# EAGLE design M410A (EAGLE 6.6.0)
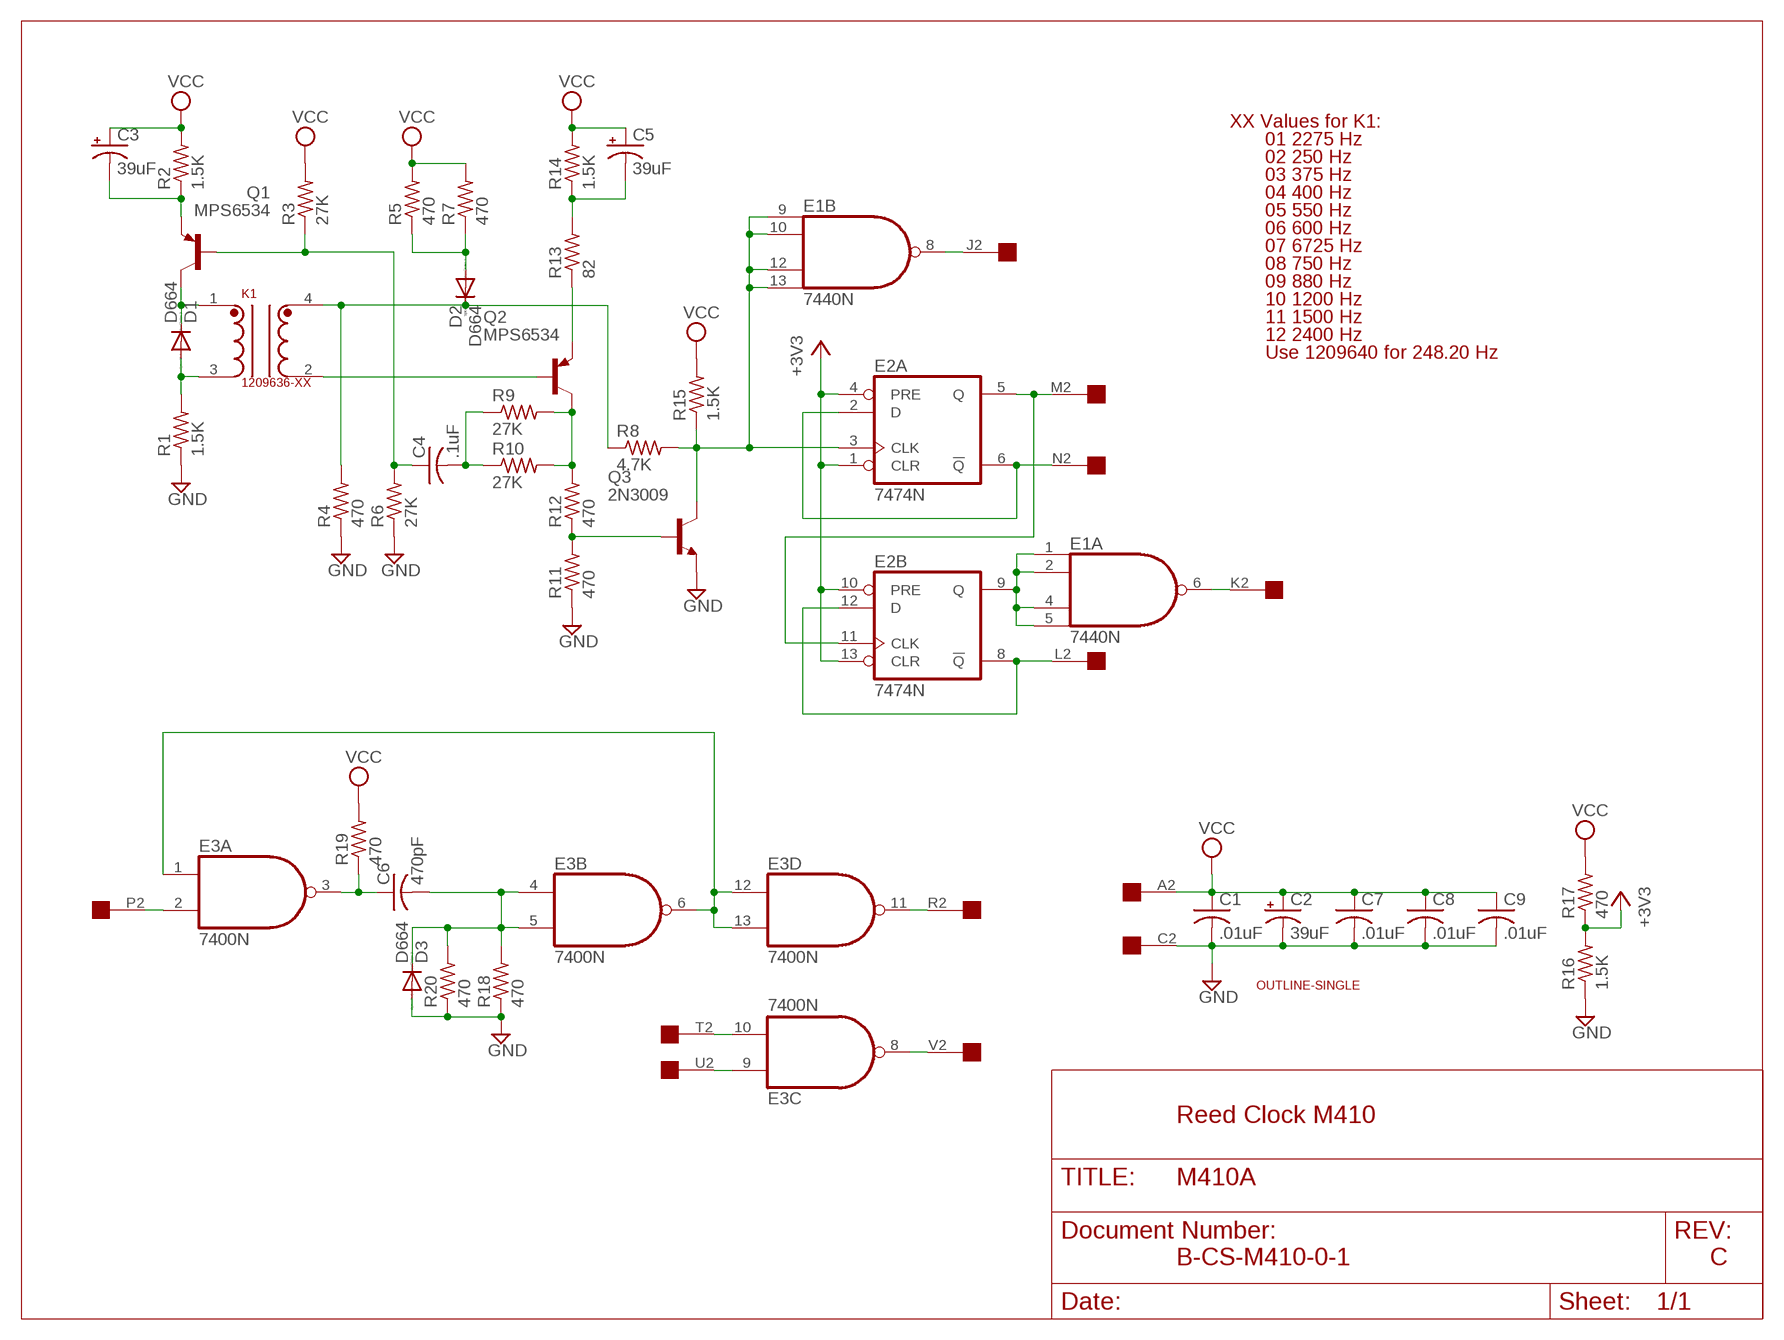
[diagram p0: schematic, sheet 1]

## Parts
C1  .01uF  C-US050-025X075  [C050-025X075]
C2  39uF  CPOL-USE20-8AXIAL  [E12-8]
C3  39uF  CPOL-USE20-8AXIAL  [E12-8]
C4  .1uF  C-US150-054X183  [C150-054X183]
C5  39uF  CPOL-USE20-8AXIAL  [E12-8]
C6  470pF  C-US075-032X103  [C075-032X103]
C7  .01uF  C-US050-025X075  [C050-025X075]
C8  .01uF  C-US050-025X075  [C050-025X075]
C9  .01uF  C-US050-025X075  [C050-025X075]
D1  D664  DIODE-DO35-10  [DO35-10]
D2  D664  DIODE-DO35-10  [DO35-10]
D3  D664  DIODE-DO35-10  [DO35-10]
E1  7440N  [DIL14]
E2  7474N  74S74N  [DIL14]
E3  7400N  [DIL14]
K1  1209636-XX  RESONATOR  [RESONATOR]
Q1  MPS6534  -PNP-TO5  [TO5]
Q2  MPS6534  -PNP-TO5  [TO5]
Q3  2N3009  -NPN-TO5  [TO5]
R1  1.5K  R-US_0207/10  [0207/10]
R2  1.5K  R-US_0207/10  [0207/10]
R3  27K  R-US_0207/10  [0207/10]
R4  470  R-US_0207/10  [0207/10]
R5  470  R-US_0207/10  [0207/10]
R6  27K  R-US_0207/10  [0207/10]
R7  470  R-US_0207/10  [0207/10]
R8  4.7K  R-US_0207/10  [0207/10]
R9  27K  R-US_0207/10  [0207/10]
R10  27K  R-US_0207/10  [0207/10]
R11  470  R-US_0207/10  [0207/10]
R12  470  R-US_0207/10  [0207/10]
R13  82  R-US_0207/10  [0207/10]
R14  1.5K  R-US_0207/10  [0207/10]
R15  1.5K  R-US_0207/10  [0207/10]
R16  1.5K  R-US_0207/10  [0207/10]
R17  470  R-US_0207/10  [0207/10]
R18  470  R-US_0207/10  [0207/10]
R19  470  R-US_0207/10  [0207/10]
R20  470  R-US_0207/10  [0207/10]
U$1  OUTLINE-SINGLE  [SINGLE]
U$3  EDGE-1  [EDGE-CON1]

## Nets
+3V3: E2.1(A:CLR) E2.4(A:PRE) E2.10(B:PRE) E2.13(B:CLR) R16.2 R17.1
GND: C1.2 C2.- C7.2 C8.2 C9.2 D3.A Q3.1(E) R1.1 R4.1 R6.1 R11.1 R16.1 R18.1 R20.1 U$3.C2
N$1: E3.8(C:O) U$3.V2
N$2: E3.10(C:I1) U$3.T2
N$3: E3.9(C:I0) U$3.U2
N$4: E3.1(A:I0) E3.6(B:O) E3.12(D:I0) E3.13(D:I1)
N$5: E3.11(D:O) U$3.R2
N$6: C6.2 D3.C E3.4(B:I0) E3.5(B:I1) R18.2 R20.2
N$7: C6.1 E3.3(A:O) R19.1
N$8: E2.2(A:D) E2.6(A:!Q) U$3.N2
N$9: E2.5(A:Q) E2.11(B:CLK) U$3.M2
N$10: E2.8(B:!Q) E2.12(B:D) U$3.L2
N$11: E1.1(A:I0) E1.2(A:I1) E1.4(A:I2) E1.5(A:I3) E2.9(B:Q)
N$12: E1.6(A:O) U$3.K2
N$13: C3.- Q1.1(E) R2.1
N$14: E1.9(B:I0) E1.10(B:I1) E1.12(B:I2) E1.13(B:I3) E2.3(A:CLK) Q3.3(C) R8.2 R15.1
N$15: E1.8(B:O) U$3.J2
N$16: E3.2(A:I1) U$3.P2
N$17: D1.A K1.3 R1.2
N$18: D1.C K1.1 Q1.3(C)
N$19: C4.1 Q1.2(B) R3.1 R6.2
N$20: D2.A R5.1 R7.1
N$21: K1.2 Q2.2(B)
N$22: D2.C K1.4 R4.2 R8.1
N$23: C4.2 R9.1 R10.1
N$24: Q2.3(C) R9.2 R10.2 R12.2
N$26: C5.- R13.2 R14.1
N$27: Q2.1(E) R13.1
N$28: Q3.2(B) R11.2 R12.1
VCC: C1.1 C2.+ C3.+ C5.+ C7.1 C8.1 C9.1 R2.2 R3.2 R5.2 R7.2 R14.2 R15.2 R17.2 R19.2 U$3.A2
Unconnected: E1.3(3:NC) E1.11(11:NC) U$3.B2 U$3.D2 U$3.E2 U$3.F2 U$3.H2 U$3.S2

## Notes on the sheet
- XX Values for K1:
- 01 2275 Hz
- 02 250 Hz
- 03 375 Hz
- 04 400 Hz
- 05 550 Hz
- 06 600 Hz
- 07 6725 Hz
- 08 750 Hz
- 09 880 Hz
- 10 1200 Hz
- 11 1500 Hz
- 12 2400 Hz
- Use 1209640 for 248.20 Hz
- Reed Clock M410
- B-CS-M410-0-1 | C

## Power pins joined to a net without a drawn wire
GND: E1.7(P:GND) E2.7(P:GND) E3.7(P:GND)
VCC: E1.14(P:VCC) E2.14(P:VCC) E3.14(P:VCC)

## Library data of the parts
C1 C4 C6-C9 = rcl:C-US: CAPACITOR, American symbol
C2 C3 C5 = dec-con:CPOL-USE20-8AXIAL: A 0.8 inch electrolytic.
D1-D3 = diode:DIODE-: DIODE
E1 = dec-con:74*40: Dual 4-input NAND gate
E2 = 74xx-us:74*74: Dual D type positive edge triggered FLIP FLOP, preset and clear
E3 = 74xx-us:74*00: Quad 2-input NAND gate
K1 = dec-con:RESONATOR: Reed Resonator
Q1 Q2 = transistor:*-PNP-: PNP Transistror
Q3 = transistor:*-NPN-: NPN Transistror BF959 corrected 2008.03.06
R1-R20 = rcl:R-US_: RESISTOR, American symbol
U$1 = dec-con:OUTLINE-*: Board outlines for DEC boards.
U$3 = dec-con:EDGE-1: Single-Sided DEC Edge Connector -- (side 2)

## Net classes
0 default: width 0.813 mm

## Board
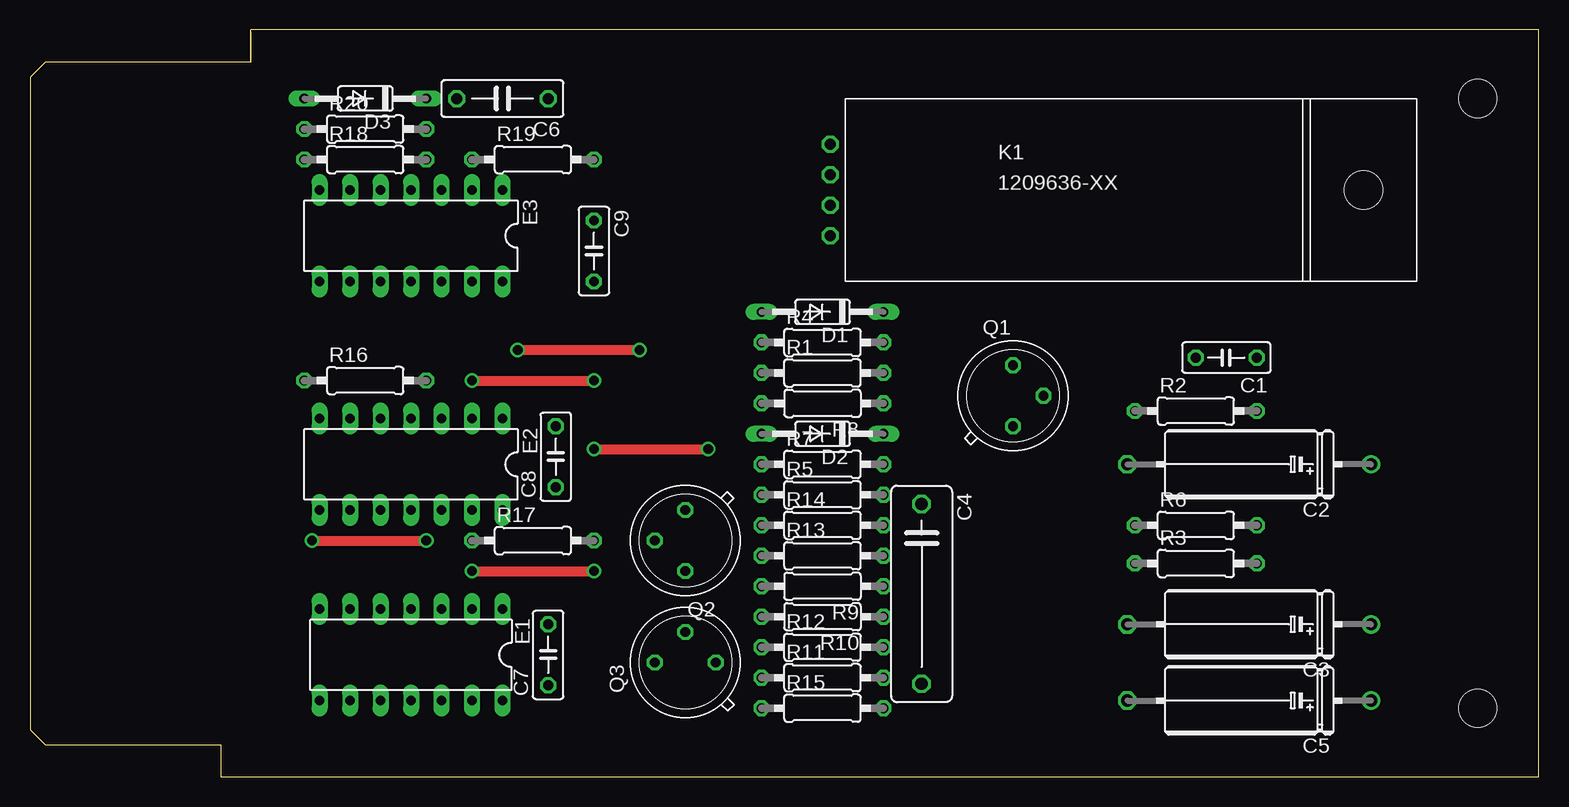
[diagram p1: board, top side]
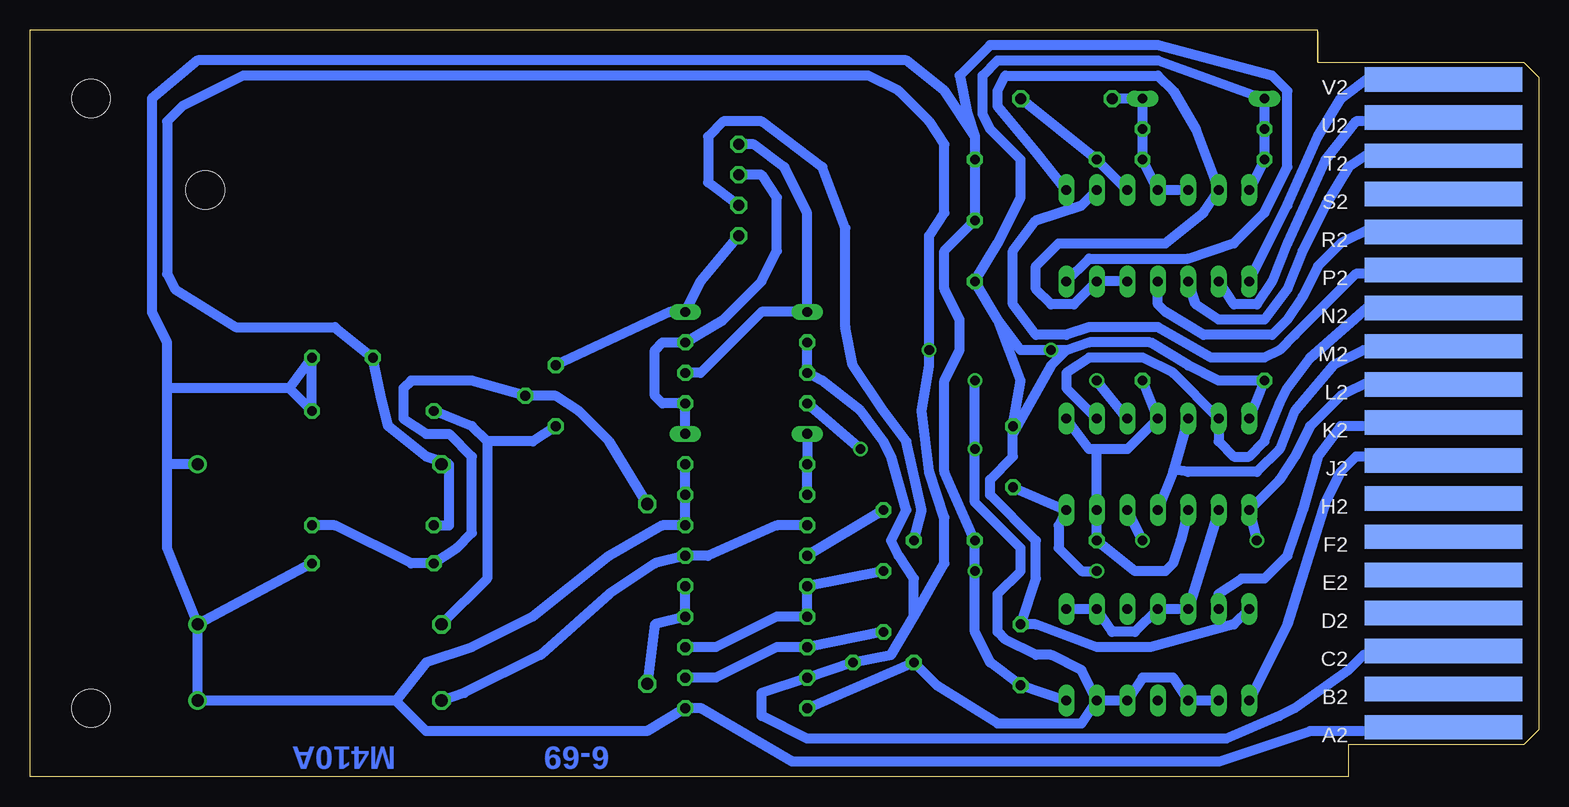
[diagram p2: board, bottom side, seen from below]

Size 125.73 x 62.23 mm. Coordinates in mm from the lower left corner, seen from the top.
Copper layers (1+16): Top 0.035mm / dielectric 1.5mm / Bottom 0.035mm
Design rules "16mils": minimum track width 16mil, minimum drill 32mil, track to track 15mil, track to pad 10mil, pad to pad 10mil, via to via 10mil, smd to smd 10mil, copper to edge 13mil, drill to drill 10mil, minimum pad ring 10mil, minimum via ring 8mil, stop-mask expansion 0mil, vias tented up to drill 0mil, thermal gap 10mil

### Footprints (pad centres in the part's own frame; a part is rotated, then mirrored left to right if it is on the bottom)
C050-025X075 = drill 0.813 octagon: 1 -2.54,0; 2 2.54,0
E12-8 = drill 1.016: + -10.16,0 | drill 1.016 octagon: - 10.16,0
C150-054X183 = drill 1.016 octagon: 1 -7.493,0; 2 7.493,0
C075-032X103 = drill 0.914 octagon: 1 -3.81,0; 2 3.81,0
DO35-10 = drill 0.813 long: A 5.08,0; C -5.08,0
DIL14 = drill 0.813 long: 1 -7.62,-3.81; 2 -5.08,-3.81; 3 -2.54,-3.81; 4 0,-3.81; 5 2.54,-3.81; 6 5.08,-3.81; 7 7.62,-3.81; 8 7.62,3.81; 9 5.08,3.81; 10 2.54,3.81; 11 0,3.81; 12 -2.54,3.81; 13 -5.08,3.81; 14 -7.62,3.81
RESONATOR = drill 0.9 octagon: 1 -1.27,3.81; 2 -1.27,6.35; 3 -1.27,11.43; 4 -1.27,8.89 | hole 3.2: 43.18,7.62
TO5 = drill 0.813 octagon: 1 0,-2.54; 2 2.54,0; 3 0,2.54
0207/10 = drill 0.813 octagon: 1 -5.08,0; 2 5.08,0
SINGLE = hole 3.175: 120.65,56.515; 120.65,5.715
EDGE-CON1 = smd 13.106 x 2.032 bottom: A2 7.938,4.128; B2 7.938,7.303; C2 7.938,10.477; D2 7.938,13.652; E2 7.938,16.828; F2 7.938,20.003; H2 7.938,23.177; J2 7.938,26.352; K2 7.938,29.527; L2 7.938,32.703; M2 7.938,35.877; N2 7.938,39.053; P2 7.938,42.227; R2 7.938,45.403; S2 7.938,48.578; T2 7.938,51.752; U2 7.938,54.928; V2 7.938,58.102

### Placement (x,y rotation side)
C1  99.7,34.92 180 top
C2  101.6,26.04 180 top
C3  101.6,12.7 180 top
C4  74.3,15.24 270 top
C5  101.6,6.35 180 top
C6  39.37,56.52 180 top
C7  43.18,10.16 90 top
C8  43.82,26.67 90 top
C9  46.99,43.81 270 top
D1  66.04,38.73 180 top
D2  66.04,28.57 180 top
D3  27.94,56.52 180 top
E1  31.75,10.16 180 top
E2  31.75,26.04 180 top
E3  31.75,45.09 180 top
K1  67.95,41.27 0 top
Q1  81.92,31.75 0 top
Q2  54.61,19.68 180 top
Q3  54.61,9.53 90 top
R1  66.04,33.66 0 top
R2  97.16,30.48 0 top
R3  97.16,17.78 0 top
R4  66.04,36.2 0 top
R5  66.04,23.5 0 top
R6  97.16,20.95 0 top
R7  66.04,26.04 0 top
R8  66.04,31.11 180 top
R9  66.04,15.88 180 top
R10  66.04,13.34 180 top
R11  66.04,8.26 0 top
R12  66.04,10.79 0 top
R13  66.04,18.41 0 top
R14  66.04,20.95 0 top
R15  66.04,5.71 0 top
R16  27.94,33.02 0 top
R17  41.91,19.68 0 top
R18  27.94,51.44 0 top
R19  41.91,51.44 0 top
R20  27.94,53.98 0 top
U$1  0,0 0 top
U$3  0,0 0 top

### Tracks (layer width: path | path; a pad name or v marks a point on that pad's centre or on a via)
+3V3
  Bottom 0.813: 36.83,27.3 34.29,27.3 E2.4 R16.2 | 36.83,27.3 37.47,27.3 E2.1 | 36.83,27.3 E2.13 R17.1 33.66,17.14 31.12,17.14 30.48,17.78 29.85,19.68 E2.10
GND  (via drill 0.81)
  Top 0.813: v50.8,35.56 v40.64,35.56
  Bottom 0.813: U$3.C2 8.89,10.48 8.89,10.16 14.61,10.16 15.88,8.89 20.32,5.71 21.59,5.08 26.04,3.17 60.96,3.17 64.77,5.08 64.77,6.99 R11.1 Q3.1 53.98,10.16 52.07,13.34 | 52.07,13.34 52.07,16.51 53.34,18.41 53.98,19.68 52.71,22.23 53.98,26.67 54.61,27.94 56.52,30.48 59.69,33.02 R1.1 R4.1 | E1.7 25.4,12.7 32.39,10.79 36.83,10.79 41.91,12.7 C7.2 41.91,16.51 41.91,19.68 45.72,23.5 45.72,24.77 43.82,26.67 43.82,28.57 | 43.82,28.57 C8.2 43.18,33.02 45.09,38.1 | E2.7 R16.1 26.67,33.02 29.21,34.29 32.39,36.2 37.47,36.2 39.37,35.56 | 39.37,35.56 v40.64,35.56 43.18,35.56 45.09,38.1 | 39.37,35.56 40.64,34.29 43.82,28.57 | 45.09,38.1 C9.2 45.09,44.45 43.18,48.26 43.18,51.44 45.72,53.98 46.36,55.24 46.36,58.42 45.09,59.69 31.75,59.69 D3.A R20.1 R18.1 E3.7 | R6.1 90.81,20.95 90.81,26.04 | C2.- 90.81,26.04 | 90.81,26.04 92.71,26.67 95.89,29.21 96.52,31.75 C1.2 100.33,37.47 108.59,37.47 113.67,40.64 114.3,41.91 114.3,54.61 113.03,55.88 107.95,58.42 55.88,58.42 53.34,57.15 50.8,54.61 49.53,52.7 49.53,46.99 50.8,45.09 v50.8,35.56 50.8,34.29 51.44,30.48 50.8,25.4 49.53,21.59 49.53,17.78 52.07,13.34
N$1
  Bottom 0.813: E3.8 20.96,47.62 18.42,53.34 16.51,56.52 13.97,58.42 8.89,58.42 U$3.V2
N$2
  Bottom 0.813: U$3.T2 8.89,52.07 13.97,52.07 15.88,50.8 17.78,47.62 19.69,43.81 20.96,40.64 22.86,38.1 26.67,38.1 28.58,39.37 E3.10
N$3
  Bottom 0.813: U$3.U2 8.89,54.61 15.24,54.61 17.78,51.44 20.96,44.45 22.23,41.27 23.5,39.37 25.4,39.37 E3.9
N$4
  Bottom 0.813: E3.12 E3.13 38.74,39.37 40.64,39.37 41.91,40.64 41.91,42.55 40.01,44.45 31.12,44.45 27.94,46.99 E3.6 28.58,53.98 30.48,57.15 31.75,58.42 44.45,58.42 45.09,57.15 45.09,55.88 41.91,52.07 E3.1
N$5
  Bottom 0.813: U$3.R2 8.89,45.72 13.97,45.72 16.51,44.45 18.42,42.55 19.69,40.01 20.96,38.1 22.23,36.83 27.94,36.83 31.12,38.73 31.75,39.37 E3.11
N$6
  Bottom 0.813: E3.5 E3.4 R18.2 R20.2 D3.C C6.2
N$7
  Bottom 0.813: E3.3 R19.1 C6.1
N$8
  Bottom 0.813: U$3.N2 8.89,39.37 13.97,39.37 19.05,34.92 20.96,32.38 21.59,31.11 22.86,27.94 24.13,26.67 25.4,26.67 26.67,27.94 E2.6 30.48,33.66 33.02,34.92 37.47,34.92 39.37,33.66 39.37,32.38 E2.2
N$9
  Bottom 0.813: E2.5 30.43,25.57 | 30.43,25.57 30.48,25.4 E2.11 | U$3.M2 8.89,35.56 14.61,35.56 17.15,34.29 20.32,30.48 21.59,27.3 23.5,25.4 29.21,25.4 30.43,25.57
N$10  (via drill 0.81)
  Top 0.813: v23.5,19.68 v33.02,19.68
  Bottom 0.813: v23.5,19.68 E2.8 21.59,24.77 20.32,26.67 19.05,29.21 16.51,31.75 13.97,33.02 8.89,33.02 U$3.L2 | v33.02,19.68 E2.12
N$11
  Bottom 0.813: E2.9 E1.5 E1.4 33.66,12.06 35.56,12.06 E1.2 E1.1
N$12
  Bottom 0.813: U$3.K2 8.89,29.21 16.51,29.21 18.42,26.67 19.69,22.23 20.96,18.41 22.86,16.51 24.77,16.51 26.67,15.24 E1.6
N$13
  Bottom 0.813: Q1.1 83.82,27.94 87.63,27.94 | 87.63,27.94 87.63,16.51 C3.- | 87.63,27.94 88.9,29.21 R2.1
N$14  (via drill 0.81)
  Top 0.813: v36.83,33.02 v46.99,33.02 | v46.99,27.3 v56.52,27.3
  Bottom 0.813: E1.9 E1.10 30.48,8.26 33.02,8.26 E1.12 E1.13 | E1.13 38.1,4.45 45.09,4.45 50.17,7.62 Q3.3 R15.1 | E1.13 38.1,8.89 40.64,10.16 41.91,10.16 44.45,11.43 45.09,12.06 45.09,15.24 43.18,17.14 43.18,19.05 46.99,22.86 v46.99,27.3 v46.99,33.02 | E2.3 v36.83,33.02 | R8.2 v56.52,27.3
N$15
  Bottom 0.813: U$3.J2 8.89,26.67 15.24,26.67 16.51,25.4 17.78,22.86 20.96,12.7 E1.8
N$16
  Bottom 0.813: U$3.P2 8.89,41.91 15.24,41.91 20.32,36.83 21.59,35.56 22.86,34.92 27.31,34.92 31.75,37.47 37.47,37.47 39.37,36.83 41.91,36.83 43.82,39.37 43.82,43.81 41.91,46.35 38.1,47.62 E3.2
N$17
  Bottom 0.813: R1.2 69.85,33.66 64.77,38.73 D1.A 60.96,46.99 62.87,50.8 65.41,52.7 K1.3
N$18
  Bottom 0.813: Q1.3 72.39,38.73 D1.C 69.85,41.27 K1.1
N$19
  Bottom 0.813: R6.2 100.33,20.95 93.98,17.78 R3.1 90.17,19.05 88.9,20.32 88.9,26.67 90.81,28.57 92.71,28.57 94.62,29.84 94.62,32.38 93.98,33.02 88.9,33.02 Q1.2 81.92,31.75 80.01,30.48 77.47,27.94 C4.1
N$20
  Bottom 0.813: R5.1 R7.1 D2.A
N$21
  Bottom 0.813: Q2.2 51.44,22.23 52.71,27.94 54.61,30.48 57.15,34.29 57.79,37.47 57.79,45.72 59.69,50.8 64.77,54.61 67.95,54.61 69.22,53.34 69.22,49.53 K1.2
N$22
  Bottom 0.813: D2.C R8.1 73.03,31.11 73.66,31.75 73.66,35.56 73.03,36.2 R4.2 67.95,38.1 64.77,41.27 63.5,43.81 63.5,48.26 64.77,50.16 K1.4
N$23
  Bottom 0.813: R9.1 R10.1 73.66,12.7 C4.2 74.3,7.62
N$24
  Bottom 0.813: R12.2 68.58,10.79 63.5,13.34 R10.2 R9.2 Q2.3
N$26
  Bottom 0.813: R14.1 63.5,20.95 69.22,18.41 R13.2 73.66,17.78 77.47,15.24 83.19,10.16 89.54,6.99 C5.-
N$27
  Bottom 0.813: Q2.1 R13.1
N$28
  Bottom 0.813: Q3.2 R12.1 63.5,10.79 68.58,8.26 R11.2
VCC  (via drill 0.81)
  Top 0.813: v36.83,17.14 v46.99,17.14
  Bottom 0.813: U$3.A2 8.89,3.81 19.05,3.81 26.67,1.27 62.23,1.27 69.85,5.71 R15.2 74.3,3.81 92.71,3.81 95.25,6.35 | 95.25,6.35 C5.+ C3.+ | C3.+ 114.3,19.05 114.3,26.04 | 114.3,26.04 114.3,32.38 | 114.3,32.38 114.3,36.2 115.57,38.73 115.57,56.52 111.76,59.69 52.71,59.69 49.53,57.15 46.99,53.34 | E1.14 C7.1 45.72,9.53 46.99,12.06 v46.99,17.14 R17.2 49.53,25.4 49.53,33.02 48.26,35.56 48.26,38.1 49.53,40.64 49.53,43.81 C9.1 R19.2 46.99,53.34 | v36.83,17.14 38.1,17.14 40.01,19.05 40.01,20.95 E2.14 C8.1 | 95.25,6.35 92.71,9.53 88.9,10.79 83.82,13.34 77.47,18.41 73.03,20.95 R14.2 R5.2 R7.2 | E3.14 37.47,43.18 29.21,43.18 25.4,44.45 22.86,46.99 20.96,50.8 20.96,57.15 22.23,58.42 31.75,60.96 45.72,60.96 48.26,58.42 47.63,55.24 46.99,53.34 | R3.2 C3.+ | C2.+ 114.3,26.04 | 104.14,32.38 R2.2 C1.1 104.14,32.38 | 104.14,32.38 114.3,32.38

### Text on the board
Bottom: 6-69 | M410A